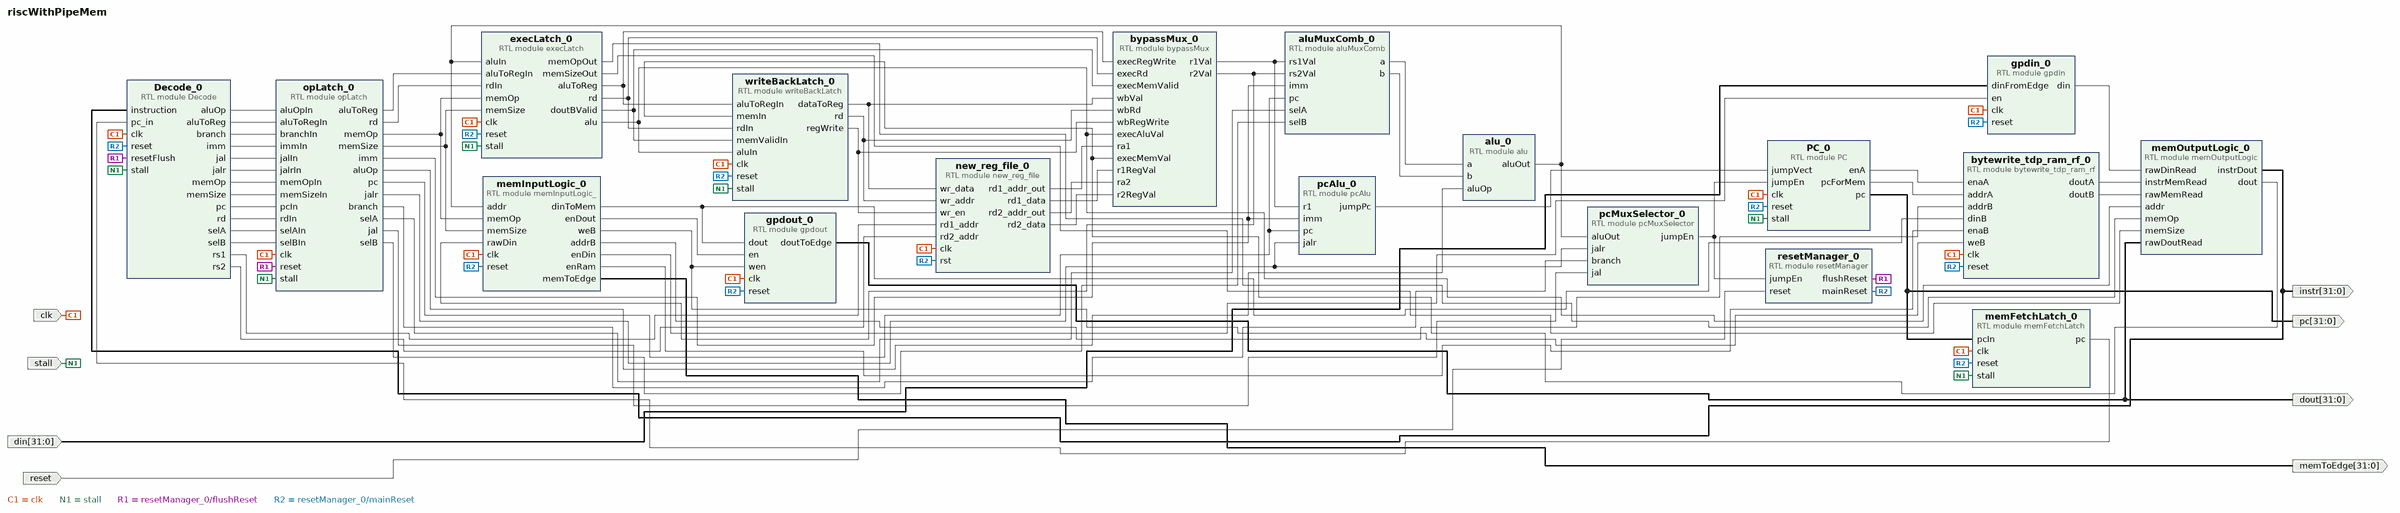
[diagram p0: block diagram of the top level]
# Vivado block design riscWithPipeMem, xc7z007sclg400-1, Vivado 2023.1
create_bd_design riscWithPipeMem

create_bd_port -dir I reset
create_bd_port -dir I -type clk clk
set_property -dict {CONFIG.FREQ_HZ 100000000} [get_bd_ports clk]
create_bd_port -dir I stall
create_bd_port -dir O -from 31 -to 0 memToEdge
create_bd_port -dir O -from 31 -to 0 pc
create_bd_port -dir O -from 31 -to 0 instr
create_bd_port -dir I -from 31 -to 0 din
create_bd_port -dir O -from 31 -to 0 dout

create_bd_cell -type module -reference memFetchLatch memFetchLatch_0
create_bd_cell -type module -reference bypassMux bypassMux_0
create_bd_cell -type module -reference new_reg_file new_reg_file_0
create_bd_cell -type module -reference PC PC_0
create_bd_cell -type module -reference execLatch execLatch_0
create_bd_cell -type module -reference alu alu_0
create_bd_cell -type module -reference pcAlu pcAlu_0
create_bd_cell -type module -reference pcMuxSelector pcMuxSelector_0
create_bd_cell -type module -reference Decode Decode_0
create_bd_cell -type module -reference memInputLogic_ memInputLogic_0
create_bd_cell -type module -reference gpdin gpdin_0
create_bd_cell -type module -reference gpdout gpdout_0
create_bd_cell -type module -reference bytewrite_tdp_ram_rf bytewrite_tdp_ram_rf_0
create_bd_cell -type module -reference memOutputLogic memOutputLogic_0
create_bd_cell -type module -reference aluMuxComb aluMuxComb_0
create_bd_cell -type module -reference opLatch opLatch_0
create_bd_cell -type module -reference resetManager resetManager_0
create_bd_cell -type module -reference writeBackLatch writeBackLatch_0

# ---- connections ----

connect_bd_net [get_bd_pins Decode_0/aluOp] [get_bd_pins opLatch_0/aluOpIn]
connect_bd_net [get_bd_pins Decode_0/aluToReg] [get_bd_pins opLatch_0/aluToRegIn]
connect_bd_net [get_bd_pins Decode_0/branch] [get_bd_pins opLatch_0/branchIn]
connect_bd_net [get_bd_pins Decode_0/imm] [get_bd_pins opLatch_0/immIn]
connect_bd_net [get_bd_pins Decode_0/jal] [get_bd_pins opLatch_0/jalIn]
connect_bd_net [get_bd_pins Decode_0/jalr] [get_bd_pins opLatch_0/jalrIn]
connect_bd_net [get_bd_pins Decode_0/memOp] [get_bd_pins opLatch_0/memOpIn]
connect_bd_net [get_bd_pins Decode_0/memSize] [get_bd_pins opLatch_0/memSizeIn]
connect_bd_net [get_bd_pins Decode_0/pc] [get_bd_pins opLatch_0/pcIn]
connect_bd_net [get_bd_pins Decode_0/rd] [get_bd_pins opLatch_0/rdIn]
connect_bd_net [get_bd_pins Decode_0/rs1] [get_bd_pins new_reg_file_0/rd1_addr]
connect_bd_net [get_bd_pins Decode_0/rs2] [get_bd_pins new_reg_file_0/rd2_addr]
connect_bd_net [get_bd_pins Decode_0/selA] [get_bd_pins opLatch_0/selAIn]
connect_bd_net [get_bd_pins Decode_0/selB] [get_bd_pins opLatch_0/selBIn]
connect_bd_net [get_bd_pins PC_0/enA] [get_bd_pins bytewrite_tdp_ram_rf_0/enaA]
connect_bd_net [get_bd_pins PC_0/pc] [get_bd_ports pc] [get_bd_pins memFetchLatch_0/pcIn]
connect_bd_net [get_bd_pins PC_0/pcForMem] [get_bd_pins bytewrite_tdp_ram_rf_0/addrA]
connect_bd_net [get_bd_pins aluMuxComb_0/a] [get_bd_pins alu_0/a]
connect_bd_net [get_bd_pins aluMuxComb_0/b] [get_bd_pins alu_0/b]
connect_bd_net [get_bd_pins alu_0/aluOut] [get_bd_pins execLatch_0/aluIn] [get_bd_pins pcMuxSelector_0/aluOut] [get_bd_pins memInputLogic_0/addr]
connect_bd_net [get_bd_pins bypassMux_0/r1Val] [get_bd_pins pcAlu_0/r1] [get_bd_pins aluMuxComb_0/rs1Val]
connect_bd_net [get_bd_pins bypassMux_0/r2Val] [get_bd_pins memInputLogic_0/rawDin] [get_bd_pins aluMuxComb_0/rs2Val]
connect_bd_net [get_bd_pins bytewrite_tdp_ram_rf_0/doutA] [get_bd_pins memOutputLogic_0/instrMemRead]
connect_bd_net [get_bd_pins bytewrite_tdp_ram_rf_0/doutB] [get_bd_pins memOutputLogic_0/rawMemRead]
connect_bd_net [get_bd_ports clk] \
  [get_bd_pins memFetchLatch_0/clk] [get_bd_pins new_reg_file_0/clk] [get_bd_pins PC_0/clk] [get_bd_pins execLatch_0/clk] \
  [get_bd_pins Decode_0/clk] [get_bd_pins memInputLogic_0/clk] [get_bd_pins gpdin_0/clk] [get_bd_pins gpdout_0/clk] \
  [get_bd_pins bytewrite_tdp_ram_rf_0/clk] [get_bd_pins opLatch_0/clk] [get_bd_pins writeBackLatch_0/clk]
connect_bd_net [get_bd_ports din] [get_bd_pins gpdin_0/dinFromEdge]
connect_bd_net [get_bd_pins execLatch_0/alu] \
  [get_bd_pins bypassMux_0/execAluVal] [get_bd_pins memOutputLogic_0/addr] [get_bd_pins writeBackLatch_0/aluIn]
connect_bd_net [get_bd_pins execLatch_0/aluToReg] [get_bd_pins bypassMux_0/execRegWrite] [get_bd_pins writeBackLatch_0/aluToRegIn]
connect_bd_net [get_bd_pins execLatch_0/memOpOut] [get_bd_pins memOutputLogic_0/memOp]
connect_bd_net [get_bd_pins execLatch_0/memSizeOut] [get_bd_pins memOutputLogic_0/memSize]
connect_bd_net [get_bd_pins execLatch_0/rd] [get_bd_pins bypassMux_0/execRd] [get_bd_pins writeBackLatch_0/rdIn]
connect_bd_net -net fakeMemIO_0_doutB [get_bd_pins memOutputLogic_0/dout] [get_bd_pins bypassMux_0/execMemVal] [get_bd_pins writeBackLatch_0/memIn]
connect_bd_net [get_bd_pins gpdin_0/din] [get_bd_pins memOutputLogic_0/rawDinRead]
connect_bd_net [get_bd_pins gpdout_0/doutToEdge] [get_bd_ports dout] [get_bd_pins memOutputLogic_0/rawDoutRead]
connect_bd_net -net inferredBRAM_0_doutA [get_bd_pins memOutputLogic_0/instrDout] [get_bd_ports instr] [get_bd_pins Decode_0/instruction]
connect_bd_net [get_bd_pins memFetchLatch_0/pc] [get_bd_pins Decode_0/pc_in]
connect_bd_net [get_bd_pins memInputLogic_0/addrB] [get_bd_pins bytewrite_tdp_ram_rf_0/addrB]
connect_bd_net [get_bd_pins memInputLogic_0/dinToMem] [get_bd_pins gpdout_0/dout] [get_bd_pins bytewrite_tdp_ram_rf_0/dinB]
connect_bd_net [get_bd_pins memInputLogic_0/enDin] [get_bd_pins gpdin_0/en]
connect_bd_net [get_bd_pins memInputLogic_0/enDout] [get_bd_pins gpdout_0/en]
connect_bd_net -net memInputLogic_0_enaB [get_bd_pins memInputLogic_0/enRam] [get_bd_pins bytewrite_tdp_ram_rf_0/enaB]
connect_bd_net [get_bd_pins memInputLogic_0/memToEdge] [get_bd_ports memToEdge]
connect_bd_net [get_bd_pins memInputLogic_0/weB] [get_bd_pins gpdout_0/wen] [get_bd_pins bytewrite_tdp_ram_rf_0/weB]
connect_bd_net -net memOutputLogic_0_readValid [get_bd_pins execLatch_0/doutBValid] \
  [get_bd_pins bypassMux_0/execMemValid] [get_bd_pins writeBackLatch_0/memValidIn]
connect_bd_net [get_bd_pins new_reg_file_0/rd1_addr_out] [get_bd_pins bypassMux_0/ra1]
connect_bd_net [get_bd_pins new_reg_file_0/rd1_data] [get_bd_pins bypassMux_0/r1RegVal]
connect_bd_net [get_bd_pins new_reg_file_0/rd2_addr_out] [get_bd_pins bypassMux_0/ra2]
connect_bd_net [get_bd_pins new_reg_file_0/rd2_data] [get_bd_pins bypassMux_0/r2RegVal]
connect_bd_net [get_bd_pins opLatch_0/aluOp] [get_bd_pins alu_0/aluOp]
connect_bd_net [get_bd_pins opLatch_0/aluToReg] [get_bd_pins execLatch_0/aluToRegIn]
connect_bd_net [get_bd_pins opLatch_0/branch] [get_bd_pins pcMuxSelector_0/branch]
connect_bd_net [get_bd_pins opLatch_0/imm] [get_bd_pins pcAlu_0/imm] [get_bd_pins aluMuxComb_0/imm]
connect_bd_net [get_bd_pins opLatch_0/jal] [get_bd_pins pcMuxSelector_0/jal]
connect_bd_net [get_bd_pins opLatch_0/jalr] [get_bd_pins pcAlu_0/jalr] [get_bd_pins pcMuxSelector_0/jalr]
connect_bd_net [get_bd_pins opLatch_0/memOp] [get_bd_pins execLatch_0/memOp] [get_bd_pins memInputLogic_0/memOp]
connect_bd_net [get_bd_pins opLatch_0/memSize] [get_bd_pins execLatch_0/memSize] [get_bd_pins memInputLogic_0/memSize]
connect_bd_net [get_bd_pins opLatch_0/pc] [get_bd_pins pcAlu_0/pc] [get_bd_pins aluMuxComb_0/pc]
connect_bd_net [get_bd_pins opLatch_0/rd] [get_bd_pins execLatch_0/rdIn]
connect_bd_net [get_bd_pins opLatch_0/selA] [get_bd_pins aluMuxComb_0/selA]
connect_bd_net [get_bd_pins opLatch_0/selB] [get_bd_pins aluMuxComb_0/selB]
connect_bd_net -net orGate_0_y [get_bd_ports stall] \
  [get_bd_pins memFetchLatch_0/stall] [get_bd_pins PC_0/stall] [get_bd_pins execLatch_0/stall] [get_bd_pins Decode_0/stall] \
  [get_bd_pins opLatch_0/stall] [get_bd_pins writeBackLatch_0/stall]
connect_bd_net [get_bd_pins pcAlu_0/jumpPc] [get_bd_pins PC_0/jumpVect]
connect_bd_net [get_bd_pins pcMuxSelector_0/jumpEn] [get_bd_pins PC_0/jumpEn] [get_bd_pins resetManager_0/jumpEn]
connect_bd_net [get_bd_pins resetManager_0/flushReset] [get_bd_pins Decode_0/resetFlush] [get_bd_pins opLatch_0/reset]
connect_bd_net [get_bd_pins resetManager_0/mainReset] \
  [get_bd_pins memFetchLatch_0/reset] [get_bd_pins new_reg_file_0/rst] [get_bd_pins PC_0/reset] \
  [get_bd_pins execLatch_0/reset] [get_bd_pins Decode_0/reset] [get_bd_pins memInputLogic_0/reset] \
  [get_bd_pins gpdin_0/reset] [get_bd_pins gpdout_0/reset] [get_bd_pins bytewrite_tdp_ram_rf_0/reset] \
  [get_bd_pins writeBackLatch_0/reset]
connect_bd_net [get_bd_ports reset] [get_bd_pins resetManager_0/reset]
connect_bd_net [get_bd_pins writeBackLatch_0/dataToReg] [get_bd_pins bypassMux_0/wbVal] [get_bd_pins new_reg_file_0/wr_data]
connect_bd_net [get_bd_pins writeBackLatch_0/rd] [get_bd_pins bypassMux_0/wbRd] [get_bd_pins new_reg_file_0/wr_addr]
connect_bd_net [get_bd_pins writeBackLatch_0/regWrite] [get_bd_pins bypassMux_0/wbRegWrite] [get_bd_pins new_reg_file_0/wr_en]

validate_bd_design
save_bd_design
